# Altium project MSXIV_Front_Power_Distribution.PrjPcb (part 3 of 4)

## Sheet Power Distribution - Pi.SchDoc: Title
size B; Organization: Midnight Sun Solar Rayce Car Team; Address1: University of Waterloo; Address2: 200 University Ave W; Address3: Waterloo, ON, Canada; Address4: N2L 3E9; Website: www.uwmidsun.com; ProjectName: ProjectName
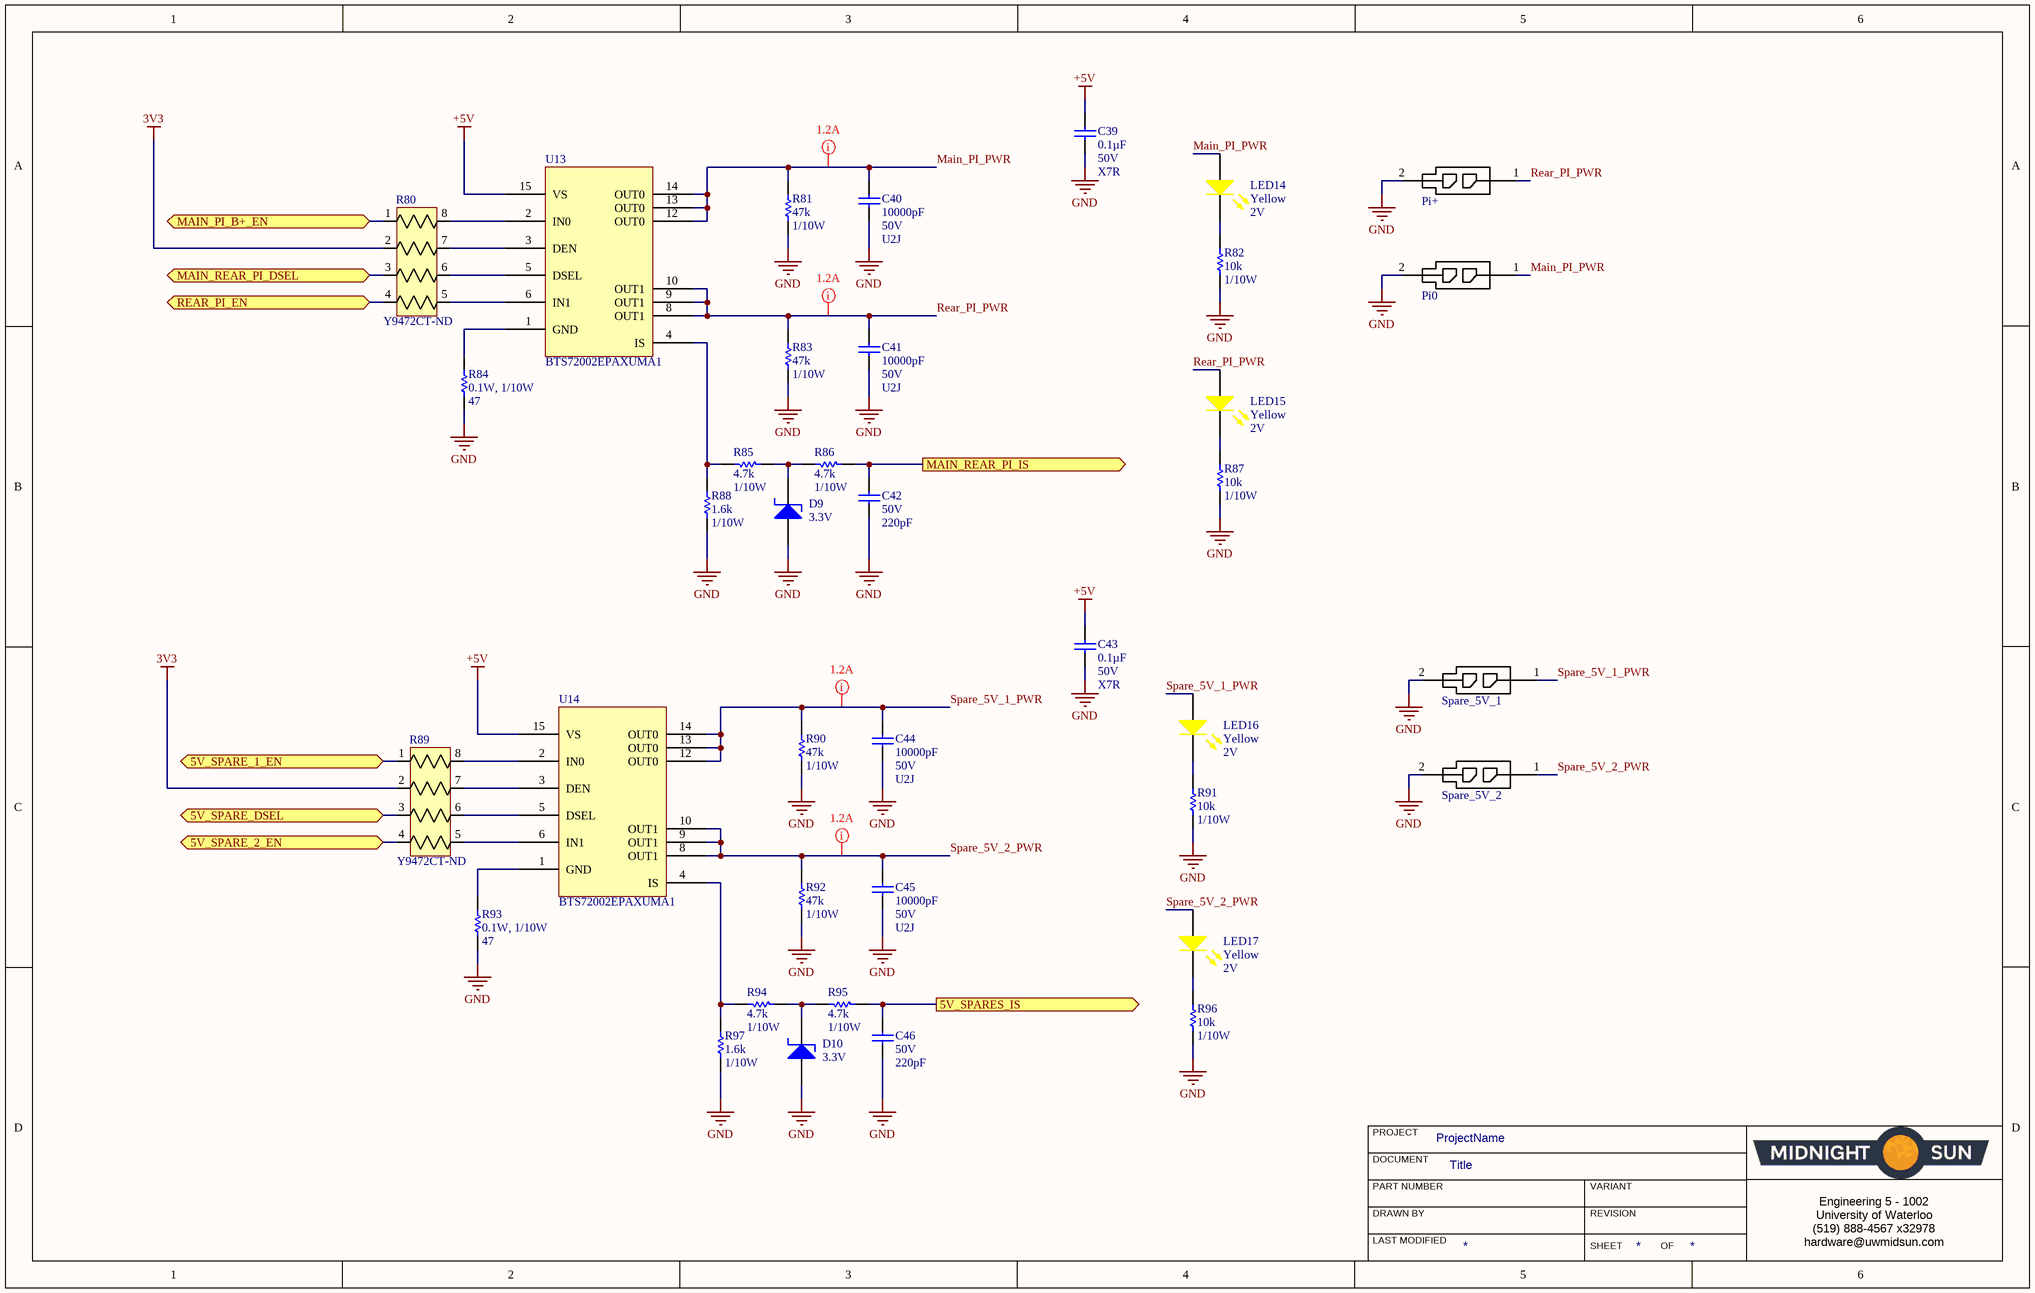
[diagram p5: Power Distribution - Pi.SchDoc]

### Parts
C39  Capacitance: 0.1µF  Voltage: 50V  Temperature Coefficient: X7R  [CAP, 0603]  (hidden comment: CAP CER 0.1UF 50V 10% X7R 0603)
C40  Capacitance: 10000pF  Voltage: 50V  Temperature Coefficient: U2J  [CAP, 0603]  (hidden comment: CAP CER 10nF 50V 5% X7R 0603)
C41  Capacitance: 10000pF  Voltage: 50V  Temperature Coefficient: U2J  [CAP, 0603]  (hidden comment: CAP CER 10nF 50V 5% X7R 0603)
C42  Voltage Rating: 50V  Capacitance: 220pF  [CAP, 0603]  (hidden comment: CAP CER 220PF 50V C0G/NP0 0603)
C43  Capacitance: 0.1µF  Voltage: 50V  Temperature Coefficient: X7R  [CAP, 0603]  (hidden comment: CAP CER 0.1UF 50V 10% X7R 0603)
C44  Capacitance: 10000pF  Voltage: 50V  Temperature Coefficient: U2J  [CAP, 0603]  (hidden comment: CAP CER 10nF 50V 5% X7R 0603)
C45  Capacitance: 10000pF  Voltage: 50V  Temperature Coefficient: U2J  [CAP, 0603]  (hidden comment: CAP CER 10nF 50V 5% X7R 0603)
C46  Voltage Rating: 50V  Capacitance: 220pF  [CAP, 0603]  (hidden comment: CAP CER 220PF 50V C0G/NP0 0603)
D9  Voltage: 3.3V  [sod-323]  (hidden comment: DIODE ZENER 3.3V 200MW SOD323)
D10  Voltage: 3.3V  [sod-323]  (hidden comment: DIODE ZENER 3.3V 200MW SOD323)
LED14  Color: Yellow  Voltage - Forward (Vf) (Typ): 2V  [LED_0603]  (hidden comment: LED YELLOW CLEAR 2.1V 0603)
LED15  Color: Yellow  Voltage - Forward (Vf) (Typ): 2V  [LED_0603]  (hidden comment: LED YELLOW CLEAR 2.1V 0603)
LED16  Color: Yellow  Voltage - Forward (Vf) (Typ): 2V  [LED_0603]  (hidden comment: LED YELLOW CLEAR 2.1V 0603)
LED17  Color: Yellow  Voltage - Forward (Vf) (Typ): 2V  [LED_0603]  (hidden comment: LED YELLOW CLEAR 2.1V 0603)
Pi0  CONN 2POS MICRO-FIT 3mm  [CONN, 2POS MICRO-FIT]  (value not drawn)
Pi+  CONN 2POS MICRO-FIT 3mm  [CONN, 2POS MICRO-FIT]  (value not drawn)
R80  Supplier Part Number 1: Y9472CT-ND  [RES ARRAY 4RES 1206]  (hidden comment: RES ARRAY 4 RES 4.7K OHM 1206)
R81  Resistance: 47k  Power Rating: 1/10W  [RES, 0603]  (hidden comment: RES 47K OHM 1% 1/10W 0603)
R82  Resistance: 10k  Power: 1/10W  [RES, 0603]  (hidden comment: RES 10K OHM 1% 1/10W 0603)
R83  Resistance: 47k  Power Rating: 1/10W  [RES, 0603]  (hidden comment: RES 47K OHM 1% 1/10W 0603)
R84  Power (Watts): 0.1W, 1/10W  Values: 47  [RES, 0603]  (hidden comment: RES SMD 47 OHM 1% 1/10W 0603)
R85  Resistance (Ohms): 4.7k  Power (Watts): 1/10W  [RES, 0603]  (hidden comment: RES 4.7K OHM 1% 1/10W 0603)
R86  Resistance (Ohms): 4.7k  Power (Watts): 1/10W  [RES, 0603]  (hidden comment: RES 4.7K OHM 1% 1/10W 0603)
R87  Resistance: 10k  Power: 1/10W  [RES, 0603]  (hidden comment: RES 10K OHM 1% 1/10W 0603)
R88  Resistance: 1.6k  Power Rating: 1/10W  [RES, 0603]  (hidden comment: RES 1.6K OHM 1% 1/10W 0603)
R89  Supplier Part Number 1: Y9472CT-ND  [RES ARRAY 4RES 1206]  (hidden comment: RES ARRAY 4 RES 4.7K OHM 1206)
R90  Resistance: 47k  Power Rating: 1/10W  [RES, 0603]  (hidden comment: RES 47K OHM 1% 1/10W 0603)
R91  Resistance: 10k  Power: 1/10W  [RES, 0603]  (hidden comment: RES 10K OHM 1% 1/10W 0603)
R92  Resistance: 47k  Power Rating: 1/10W  [RES, 0603]  (hidden comment: RES 47K OHM 1% 1/10W 0603)
R93  Power (Watts): 0.1W, 1/10W  Values: 47  [RES, 0603]  (hidden comment: RES SMD 47 OHM 1% 1/10W 0603)
R94  Resistance (Ohms): 4.7k  Power (Watts): 1/10W  [RES, 0603]  (hidden comment: RES 4.7K OHM 1% 1/10W 0603)
R95  Resistance (Ohms): 4.7k  Power (Watts): 1/10W  [RES, 0603]  (hidden comment: RES 4.7K OHM 1% 1/10W 0603)
R96  Resistance: 10k  Power: 1/10W  [RES, 0603]  (hidden comment: RES 10K OHM 1% 1/10W 0603)
R97  Resistance: 1.6k  Power Rating: 1/10W  [RES, 0603]  (hidden comment: RES 1.6K OHM 1% 1/10W 0603)
Spare_5V_1  CONN 2POS MICRO-FIT 3mm  [CONN, 2POS MICRO-FIT]  (value not drawn)
Spare_5V_2  CONN 2POS MICRO-FIT 3mm  [CONN, 2POS MICRO-FIT]  (value not drawn)
U13  Manufacturer Part Number: BTS72002EPAXUMA1  [IC LOAD SWITCH PG-TSDSO-14-22]  (hidden comment: IC LOAD SWITCH BTS7200-2EPA PG-TSDSO-14_1)
U14  Manufacturer Part Number: BTS72002EPAXUMA1  [IC LOAD SWITCH PG-TSDSO-14-22]  (hidden comment: IC LOAD SWITCH BTS7200-2EPA PG-TSDSO-14_1)

### Ports
5V_SPARE_1_EN (bidir), 5V_SPARE_2_EN (bidir), 5V_SPARE_DSEL (bidir), 5V_SPARES_IS (out), MAIN_PI_B+_EN (bidir), MAIN_REAR_PI_DSEL (bidir), MAIN_REAR_PI_IS (out), REAR_PI_EN (bidir)

### Nets
3V3: R80.2 R89.2
+5V: C39.1 C43.1 U13.15(VS) U14.15(VS)
GND: C39.2 C40.2 C41.2 C42.2 C43.2 C44.2 C45.2 C46.2 D9.1(A) D10.1(A) Pi0.2 Pi+.2 R81.2 R82.2 R83.2 R84.2 R87.2 R88.2 R90.2 R91.2 R92.2 R93.2 R96.2 R97.2 Spare_5V_1.2 Spare_5V_2.2
Main_PI_PWR: C40.1 LED14.1(A) Pi0.1 R81.1 U13.12(OUT0) U13.13(OUT0) U13.14(OUT0)
Rear_PI_PWR: C41.1 LED15.1(A) Pi+.1 R83.1 U13.8(OUT1) U13.9(OUT1) U13.10(OUT1)
Spare_5V_1_PWR: C44.1 LED16.1(A) R90.1 Spare_5V_1.1 U14.12(OUT0) U14.13(OUT0) U14.14(OUT0)
Spare_5V_2_PWR: C45.1 LED17.1(A) R92.1 Spare_5V_2.1 U14.8(OUT1) U14.9(OUT1) U14.10(OUT1)
NetC42_1: C42.1 R86.1 ; port MAIN_REAR_PI_IS
NetC46_1: C46.1 R95.1 ; port 5V_SPARES_IS
NetD9_2: D9.2(K) R85.1 R86.2
NetD10_2: D10.2(K) R94.1 R95.2
NetLED14_2: LED14.2(K) R82.1
NetLED15_2: LED15.2(K) R87.1
NetLED16_2: LED16.2(K) R91.1
NetLED17_2: LED17.2(K) R96.1
NetR80_1: R80.1 ; port MAIN_PI_B+_EN
NetR80_3: R80.3 ; port MAIN_REAR_PI_DSEL
NetR80_4: R80.4 ; port REAR_PI_EN
NetR80_5: R80.5 U13.6(IN1)
NetR80_6: R80.6 U13.5(DSEL)
NetR80_7: R80.7 U13.3(DEN)
NetR80_8: R80.8 U13.2(IN0)
NetR84_1: R84.1 U13.1(GND)
NetR85_2: R85.2 R88.1 U13.4(IS)
NetR89_1: R89.1 ; port 5V_SPARE_1_EN
NetR89_3: R89.3 ; port 5V_SPARE_DSEL
NetR89_4: R89.4 ; port 5V_SPARE_2_EN
NetR89_5: R89.5 U14.6(IN1)
NetR89_6: R89.6 U14.5(DSEL)
NetR89_7: R89.7 U14.3(DEN)
NetR89_8: R89.8 U14.2(IN0)
NetR93_1: R93.1 U14.1(GND)
NetR94_2: R94.2 R97.1 U14.4(IS)

### Layout directives
mark named 1.2A: Main_PI_PWR, Rear_PI_PWR, Spare_5V_1_PWR, Spare_5V_2_PWR

### Notes on the sheet
- PROJECT
- DOCUMENT
- DRAWN BY
- LAST MODIFIED
- PART NUMBER
- REVISION
- SHEET
- VARIANT
- OF
- Engineering 5 - 1002
  University of Waterloo
  (519) 888-4567 x32978
  hardware@uwmidsun.com

### Library data of the parts
C39 C43 = CAP CER 0.1UF 50V 10% X7R 0603: as C1 on sheet Controller_Board_Interface; Supplier 1: Digi-Key; Supplier Part Number 1: 478-5052-1-ND; Packaging: Cut Tape (CT); Part Status: Active; Operating Temperature: -55°C ~ 125°C; Ratings: -; Mounting Type: Surface Mount, MLCC; Package / Case: 0603 (1608 Metric); Size / Dimension: 0.063" L x 0.032" W (1.60mm x 0.81mm); Height - Seated (Max): -; Thickness (Max): 0.035" (0.90mm); Lead Spacing: -; Lead Style: -; ComponentLink1URL: http://datasheets.avx.com/X7RDielectric.pdf; ComponentLink1Description: http://datasheets.avx.com/X7RDielectric.pdf; Tolerance: ±10%
C40 C41 C44 C45 = CAP CER 10nF 50V 5% X7R 0603: as C13#1 on sheet Power Distribution - Steering, Pedal, Center Console, and Fan; Supplier 1: Digi-Key; Supplier Part Number 1: 399-13384-1-ND; Packaging: Cut Tape (CT); Part Status: Active; Operating Temperature: -55°C ~ 125°C; Ratings: -; Failure Rate: -; Mounting Type: Surface Mount, MLCC; Package / Case: 0603 (1608 Metric); Size / Dimension: 0.063" L x 0.032" W (1.60mm x 0.80mm); Height - Seated (Max): -; Thickness (Max): 0.034" (0.87mm); Lead Spacing: -; Lead Style: -; ComponentLink1URL: http://www.kemet.com/docfinder?Partnumber=C0603C103J5JAC7867; ComponentLink1Description: http://www.kemet.com/docfinder?Partnumber=C0603C103J5JAC7867; Tolerance: ±5%
C42 C46 = CAP CER 220PF 50V C0G/NP0 0603: as C2#2 on sheet Power Distribution - Steering, Pedal, Center Console, and Fan; Supplier 1: Digi-Key; Supplier Part Number 1: 399-6868-1-ND; Stock 1: 35170; Pricing 1: 1=0.14000, 10=0.09700, 100=0.04550, 500=0.03188, 1000=0.02640 (USD); RoHS: Yes; Mount: Surface Mount; Case/Package: 0603; Case Code (Metric): 1608; Case Code (Imperial): 0603; Contact Plating: Tin; Dielectric Material: Ceramic; Min Operating Temperature: -55°C; Max Operating Temperature: 125°C; Tolerance: 5%; Packaging: Tape and Reel; Package Quantity: 1; Voltage Rating (DC): 50V; Termination: SMD/SMT; Length: 1.6mm; Height: 0.8mm; Width: 0.031inch; Thickness: 0.034inch; Depth: 0.8mm; Ratings: AEC-Q200; Radiation Hardening: No; REACH SVHC: No SVHC; Lead Free: Lead Free; ComponentLink1URL: https://datasheet.ciiva.com/18192/getdatasheetpartid-416741-18192869.pdf?src-supplier=Verical; ComponentLink1Description: https://datasheet.ciiva.com/18192/getdatasheetpartid-416741-18192869.pdf?src-supplier=Verical; ComponentLink2URL: https://datasheet.ciiva.com/22694/1633156-22694015.pdf?src-supplier=Element14; ComponentLink2Description: https://datasheet.ciiva.com/22694/1633156-22694015.pdf?src-supplier=Element14; Dielectric: C0G
D9 D10 = DIODE ZENER 3.3V 200MW SOD323: as D1#1 on sheet Power Distribution - Steering, Pedal, Center Console, and Fan; ComponentLink1Description: http://www.vishay.com/docs/85764/bzx384.pdf; ComponentLink1URL: http://www.vishay.com/docs/85764/bzx384.pdf; Supplier 1: Digi-Key; Supplier Part Number 1: BZX384C3V3-E3-08GICT-ND
LED14-LED17 = LED YELLOW CLEAR 2.1V 0603: as LED2#1 on sheet Power Distribution - Steering, Pedal, Center Console, and Fan; Supplier 1: Digi-Key; RoHS: RoHS Compliant; Category: Optoelectronics; Stock 1: 10523; Pricing 1: 1=0.21, 100=0.1617, 500=0.13964 (CAD); Packaging: Cut Tape (CT); Part Status: Active; Lens Transparency: Clear; Mounting Type: Surface Mount; Wavelength - Dominant: 590nm; Features: -; Package / Case: 0603 (1608 Metric); Supplier Device Package: 0603; Size / Dimension: 1.60mm L x 0.80mm W; Height (Max): 0.80mm; ComponentLink1URL: http://katalog.we-online.de/led/datasheet/150060YS75000.pdf; ComponentLink1Description: http://katalog.we-online.de/led/datasheet/150060YS75000.pdf; Supplier Part Number 1: 732-4981-1-ND
Pi0 Pi+ Spare_5V_1 Spare_5V_2 = CONN 2POS MICRO-FIT 3mm: Connector Header Through Hole 2 position; Manufacturer: Molex; Manufacturer Part Number: 43045-0227; Number of Positions: 2; Gender: Male; Contact Resistance: 10mR; Number of Ports: 1; Max Voltage Rating (DC): 250.25kV; Current Rating: 5A; Voltage Rating: 600V; Glow Wire Compliant: Compliant; Supplier 1: Digi-Key; Stock 1: 3657; Pricing 1: 1=0.84, 10=0.74, 25=0.6968, 50=0.6676, 100=0.6387, 250=0.5806, 500=0.52254, 1000=0.46448, 2500=0.42094 (USD); Mount: Through Hole; Contact Plating: Tin; Contact Material: Brass; Housing Colour: Black; Housing Material: Thermoplastic; Number of Terminals: 2; Min Operating Temperature: -40°C; Max Operating Temperature: 105°C; Number of Rows: 2; Packaging: Tray; Termination: Solder; Number of Contacts: 2; Orientation: Vertical; Package Quantity: 3168; Number of Circuits: 2; Length: 7.15mm; Pitch: 3mm; Depth: 8.77mm; Row Spacing: 3mm; Radiation Hardening: No; Halogen Free: Low Halogen; ComponentLink1URL: http://www.onlinecomponents.com/productFiles/mf-MOL/307170430450227_pcb_headers.pdf; ComponentLink1Description: http://www.onlinecomponents.com/productFiles/mf-MOL/307170430450227_pcb_headers.pdf; ComponentLink2URL: http://www.mouser.com/ds/2/276/0430450227_PCB_HEADERS-142611.pdf; ComponentLink2Description: http://www.mouser.com/ds/2/276/0430450227_PCB_HEADERS-142611.pdf; ComponentLink3URL: http://uk.rs-online.com/webdocs/13c3/0900766b813c3a46.pdf; ComponentLink3Description: http://uk.rs-online.com/webdocs/13c3/0900766b813c3a46.pdf; ComponentLink4URL: http://www.molex.com/webdocs/datasheets/pdf/en-us/0430450227_PCB_HEADERS.pdf; ComponentLink4Description: http://www.molex.com/webdocs/datasheets/pdf/en-us/0430450227_PCB_HEADERS.pdf; Supplier Part Number 1: WM10657-ND
R80 R89 = RES ARRAY 4 RES 4.7K OHM 1206: as R23#1 on sheet Power Distribution - Steering, Pedal, Center Console, and Fan; Applications: -; Category: Resistors; Circuit Type: Isolated; Part Status: Active; Resistance (Ohms): 4.7k; Tolerance: ±5%; Power Per Element: 62.5mW; Number of Pins: 8; Operating Temperature: -55°C ~ 125°C; Mounting Type: Surface Mount; Package / Case: 1206 (3216 Metric), Convex, Long Side Terminals; Supplier Device Package: 1206; Size / Dimension: 0.126" L x 0.063" W (3.20mm x 1.60mm); Height - Seated (Max): 0.024" (0.60mm); Packaging: Cut Tape (CT); Resistor Matching Ratio: -; Resistor-Ratio-Drift: -; Series: EXB; ComponentLink1Description: https://industrial.panasonic.com/cdbs/www-data/pdf/AOC0000/AOC0000C14.pdf; ComponentLink1URL: https://industrial.panasonic.com/cdbs/www-data/pdf/AOC0000/AOC0000C14.pdf; Supplier 1: Digi-Key; Temperature Coefficient: ±200ppm/°C
R81 R83 R90 R92 = RES 47K OHM 1% 1/10W 0603: as R24#1 on sheet Power Distribution - Steering, Pedal, Center Console, and Fan; ComponentLink1URL: https://industrial.panasonic.com/cdbs/www-data/pdf/RDO0000/AOA0000C291.pdf; ComponentLink1Description: https://industrial.panasonic.com/cdbs/www-data/pdf/RDO0000/AOA0000C291.pdf; ComponentLink2URL: https://datasheet.ciiva.com/6138/aoa0000ce2-6138149.pdf?src-supplier=Farnell; ComponentLink2Description: https://datasheet.ciiva.com/6138/aoa0000ce2-6138149.pdf?src-supplier=Farnell; ComponentLink3URL: https://datasheet.ciiva.com/7802/aoa0000ce2-7802421.pdf?src-supplier=Element14; ComponentLink3Description: https://datasheet.ciiva.com/7802/aoa0000ce2-7802421.pdf?src-supplier=Element14; ComponentLink4URL: https://datasheet.ciiva.com/48531/aoa0000ce2-48531029.pdf?src-supplier=Avnet; ComponentLink4Description: https://datasheet.ciiva.com/48531/aoa0000ce2-48531029.pdf?src-supplier=Avnet; ComponentLink5URL: https://datasheet.ciiva.com/16514/aoa0000ce2-16514071.pdf?src-supplier=Avnet+Asia; ComponentLink5Description: https://datasheet.ciiva.com/16514/aoa0000ce2-16514071.pdf?src-supplier=Avnet+Asia; ComponentLink6URL: https://datasheet.ciiva.com/46398/1678782-46398088.pdf?src-supplier=Element14; ComponentLink6Description: https://datasheet.ciiva.com/46398/1678782-46398088.pdf?src-supplier=Element14; ComponentLink7URL: https://datasheet.ciiva.com/24069/aoa0000ce2-24069209.pdf?src-supplier=Mouser; ComponentLink7Description: https://datasheet.ciiva.com/24069/aoa0000ce2-24069209.pdf?src-supplier=Mouser; ComponentLink8URL: https://datasheet.ciiva.com/46398/1678782-46398089.pdf?src-supplier=Element14; ComponentLink8Description: https://datasheet.ciiva.com/46398/1678782-46398089.pdf?src-supplier=Element14; ComponentLink9URL: https://datasheet.ciiva.com/30236/aoa0000ce2-30236698.pdf?src-supplier=Onlinecomponents.com; ComponentLink9Description: https://datasheet.ciiva.com/30236/aoa0000ce2-30236698.pdf?src-supplier=Onlinecomponents.com; ComponentLink10URL: https://datasheet.ciiva.com/22722/426256-22722781.pdf?src-supplier=Element14; ComponentLink10Description: https://datasheet.ciiva.com/22722/426256-22722781.pdf?src-supplier=Element14; ComponentLink11URL: https://datasheet.ciiva.com/16758/70260748-16758831.pdf?src-supplier=Allied+Electronics; ComponentLink11Description: https://datasheet.ciiva.com/16758/70260748-16758831.pdf?src-supplier=Allied+Electronics; Supplier 1: Digi-Key; Stock 1: 1704740; Pricing 1: 1 = 0.100000, 10 = 0.065000, 100 = 0.026400, 1000 = 0.011860, 2500 = 0.010290 (USD); RoHS: Yes; Mount: Surface Mount; Case/Package: 0603; Number of Pins: 2; Case Code (Metric): 1608; Case Code (Imperial): 0603; Contact Plating: Tin; Min Operating Temperature: -55°C; Max Operating Temperature: 155°C; Tolerance: 1%; Packaging: Tape and Reel; Package Quantity: 1; Composition: Thick Film; Number of Terminations: 2; Termination: SMD/SMT; Military Standard: Not; Voltage Rating (DC): 75V; Features: Automotive AEC-Q200; Length: 1.6mm; Height: 0.022inch; Width: 0.031inch; Depth: 0.8mm; Radiation Hardening: No; REACH SVHC: No SVHC; Lead Free: Lead Free; Supplier Part Number 1: P47.0KHCT-ND
R82 R87 R91 R96 = RES 10K OHM 1% 1/10W 0603: as R4 on sheet Controller_Board_Interface; Supplier 1: Digi-Key; Supplier Part Number 1: 311-10.0KHRCT-ND; Packaging: Cut Tape (CT); Part Status: Active; Composition: Thick Film; Operating Temperature: -55°C ~ 155°C; Package / Case: 0603 (1608 Metric); Supplier Device Package: 0603; Size / Dimension: 0.063" L x 0.031" W (1.60mm x 0.80mm); Height - Seated (Max): 0.022" (0.55mm); Failure Rate: -; ComponentLink1URL: http://www.yageo.com/documents/recent/PYu-RC_Group_51_RoHS_L_7.pdf; ComponentLink1Description: http://www.yageo.com/documents/recent/PYu-RC_Group_51_RoHS_L_7.pdf; Tolerance: ±1%
R84 R93 = RES SMD 47 OHM 1% 1/10W 0603: as R45 on sheet Power Distribution - Steering, Pedal, Center Console, and Fan; Operating Temperature: -55°C ~ 155°C; Features: Automotive AEC-Q200, Moisture Resistant; Tolerance: ±1%; Composition: Thick Film; Ratings: AEC-Q200; Package / Case: 0603 (1608 Metric); Number of Terminations: 2; Height - Seated (Max): 0.022" (0.55mm); Size / Dimension: 0.063" L x 0.031" W (1.60mm x 0.80mm); ComponentLink1Description: https://www.yageo.com/upload/media/product/productsearch/datasheet/rchip/PYu-AC_51_RoHS_L_7.pdf; ComponentLink1URL: https://www.yageo.com/upload/media/product/productsearch/datasheet/rchip/PYu-AC_51_RoHS_L_7.pdf; Supplier 1: Digi-Key; Supplier Part Number 1: 311-47LDCT-ND; Supplier Device Package: 0603
R85 R86 R94 R95 = RES 4.7K OHM 1% 1/10W 0603: as R7 on sheet Controller_Board_Interface; Supplier 1: Digi-Key; Supplier Part Number 1: 311-4.70KHRCT-ND; RoHS: RoHS Compliant; Category: Resistors; Stock 1: 3487566; Pricing 1: 1=0.16, 10=0.022, 100=0.0089, 1000=0.00402, 2500=0.00349 (CAD); Packaging: Cut Tape (CT); Part Status: Active; Composition: Thick Film; Features: Moisture Resistant; Operating Temperature: -55°C ~ 155°C; Package / Case: 0603 (1608 Metric); Supplier Device Package: 0603; Size / Dimension: 0.063" L x 0.031" W (1.60mm x 0.80mm); Height - Seated (Max): 0.022" (0.55mm); Failure Rate: -; ComponentLink1URL: http://www.yageo.com/documents/recent/PYu-RC_Group_51_RoHS_L_7.pdf; ComponentLink1Description: http://www.yageo.com/documents/recent/PYu-RC_Group_51_RoHS_L_7.pdf; Tolerance: ±1%
R88 R97 = RES 1.6K OHM 1% 1/10W 0603: 1.6 kOhms ±1% 0.1W, 1/10W Chip Resistor 0603 (1608 Metric) Moisture Resistant Thick Film; Manufacturer: Yageo; Manufacturer Part Number: RC0603FR-071K6L; Voltage Rating: 50V; Temperature Coefficient: 100ppm/°C; Working Voltage: 75V; Supplier 1: Digi-Key; Stock 1: 189550; Pricing 1: 1=0.1, 10=0.015, 100=0.006, 1000=0.0027, 2500=0.0023 (USD); Case/Package: 0603; Case Code (Imperial): 0603; Case Code (Metric): 1608; Min Operating Temperature: -55°C; Max Operating Temperature: 155°C; Tolerance: 1%; Packaging: Tape and Reel; Termination: SMD/SMT; Composition: Thick Film; Military Standard: Not; Voltage Rating (DC): 50V; Number of Terminations: 2; Length: 1.6mm; Depth: 0.8mm; Lead Free: Lead Free; ComponentLink1URL: http://components.arrow.com/part/dataview/0323_00200779; ComponentLink1Description: http://components.arrow.com/part/dataview/0323_00200779; ComponentLink2URL: http://www.yageo.com.tw/exep/pages/download/literatures/PYu-R_INT-thick_7.pdf; ComponentLink2Description: http://www.yageo.com.tw/exep/pages/download/literatures/PYu-R_INT-thick_7.pdf; ComponentLink3URL: http://www.mouser.com/ds/2/447/RC0603-272842.pdf; ComponentLink3Description: http://www.mouser.com/ds/2/447/RC0603-272842.pdf; ComponentLink4URL: http://www.yageo.com/documents/recent/PYu-RC0603_51_RoHS_L_v5.pdf; ComponentLink4Description: http://www.yageo.com/documents/recent/PYu-RC0603_51_RoHS_L_v5.pdf; Supplier Part Number 1: 311-1.60KHRCT-ND
U13 U14 = IC LOAD SWITCH BTS7200-2EPA PG-TSDSO-14_1: as U6 on sheet Power Distribution - Steering, Pedal, Center Console, and Fan; Supplier 1: Digi-Key; Supplier Part Number 1: BTS72002EPAXUMA1CT-ND; Stock 1: 1973; Pricing 1: 1=1.31000, 10=1.17500, 100=0.91640, 500=0.75700, 1000=0.59763 (USD); RoHS: No; ComponentLink1Description: https://www.infineon.com/dgdl/Infineon-BTS7200-2EPA-DS-v01_00-EN.pdf?fileId=5546d462636cc8fb016421e548a61215; ComponentLink1URL: https://www.infineon.com/dgdl/Infineon-BTS7200-2EPA-DS-v01_00-EN.pdf?fileId=5546d462636cc8fb016421e548a61215

## Sheet Power Distribution - Display.SchDoc: Title
size B; Organization: Midnight Sun Solar Rayce Car Team; Address1: University of Waterloo; Address2: 200 University Ave W; Address3: Waterloo, ON, Canada; Address4: N2L 3E9; Website: www.uwmidsun.com; ProjectName: ProjectName
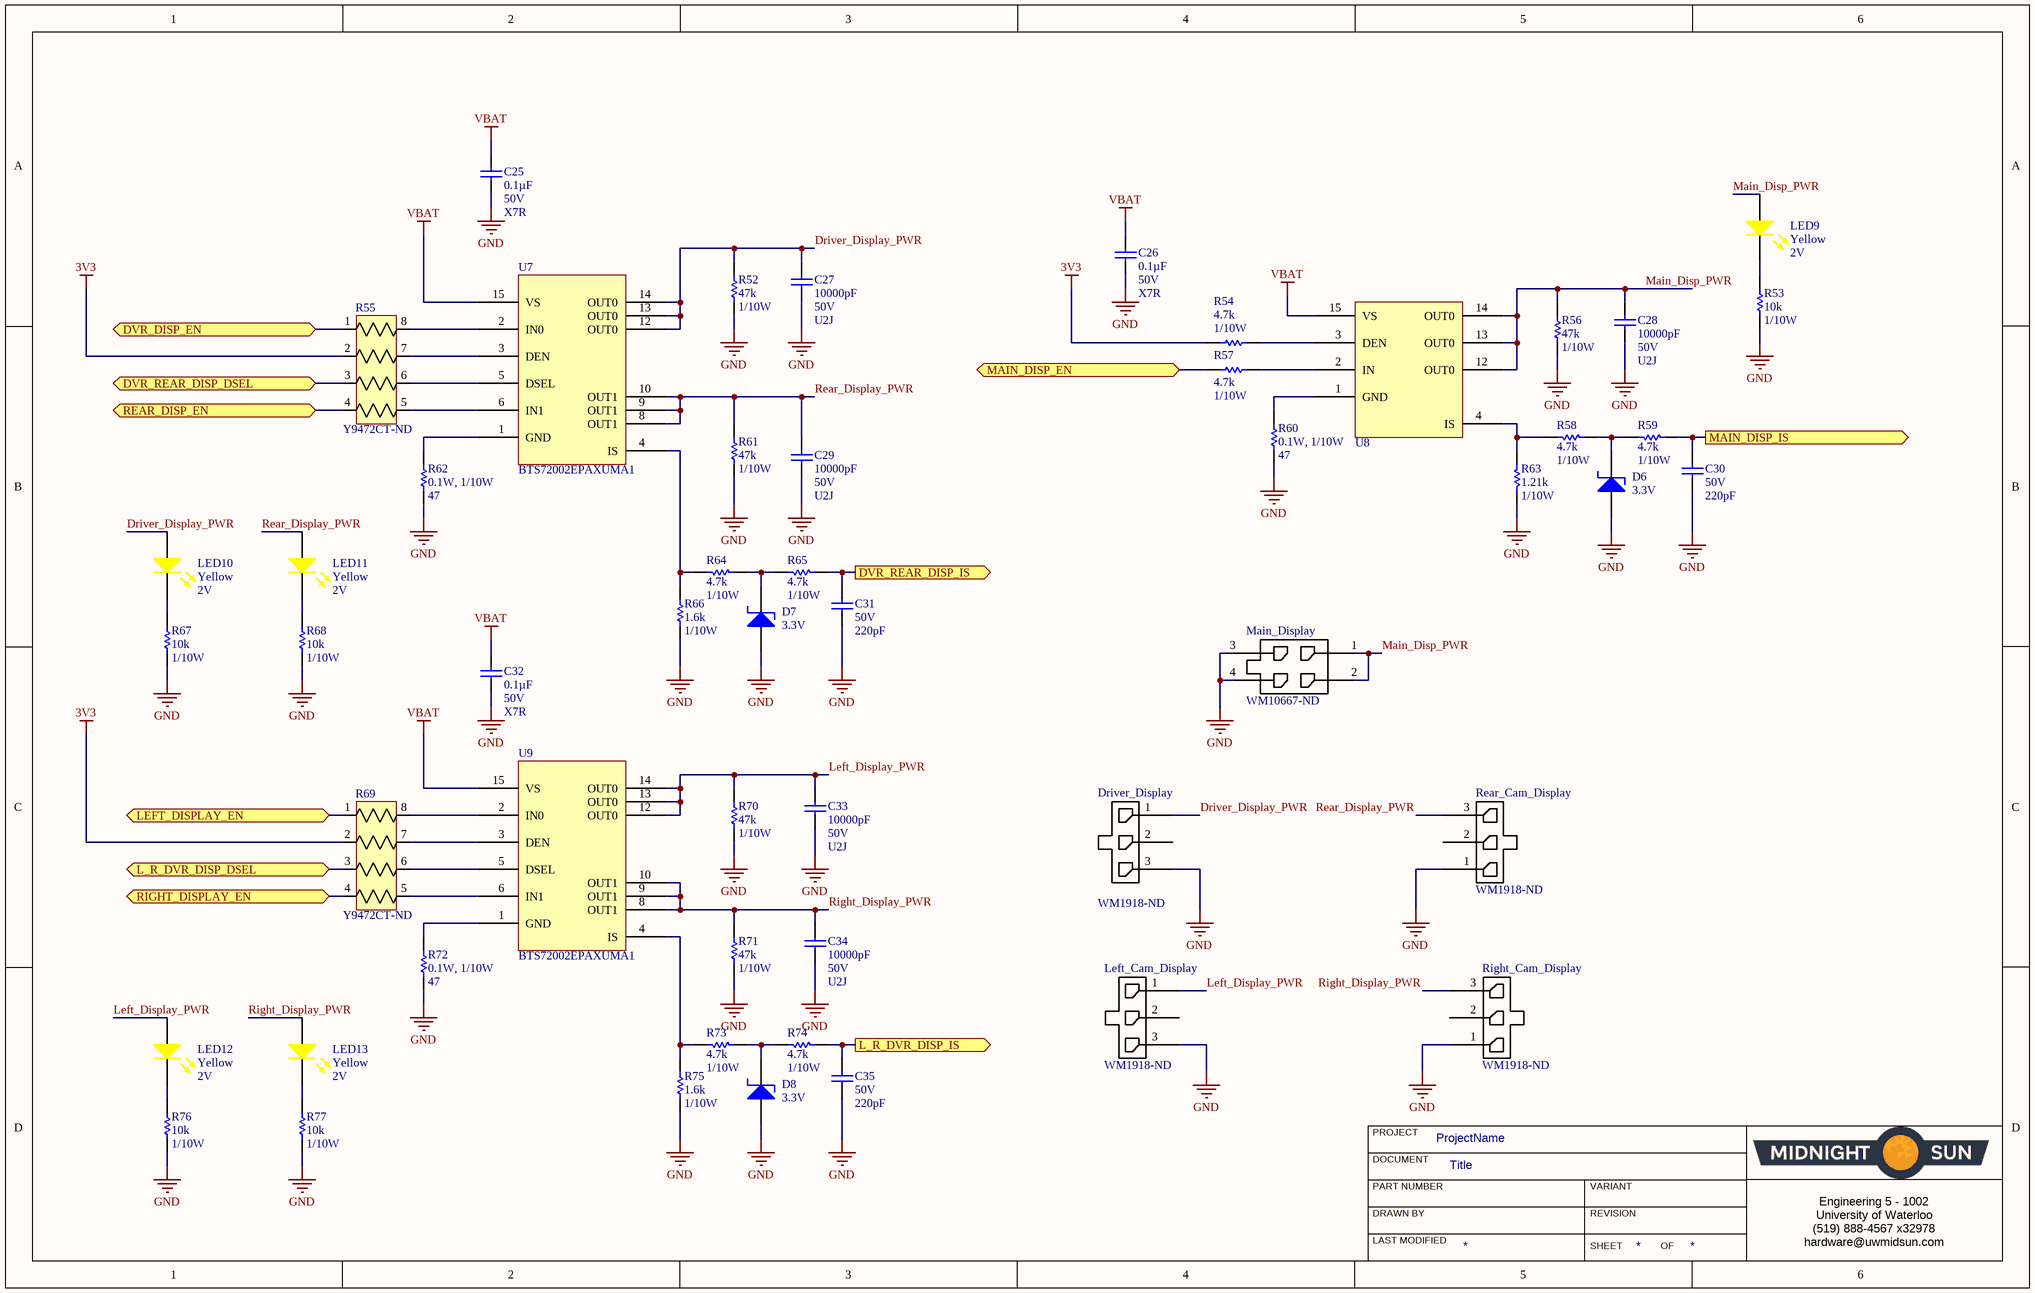
[diagram p6: Power Distribution - Display.SchDoc]

### Parts
(Parts that share a designator on the sheet are numbered #1, #2 ... from top to bottom, then left to right.)
C25  Capacitance: 0.1µF  Voltage: 50V  Temperature Coefficient: X7R  [CAP, 0603]  (hidden comment: CAP CER 0.1UF 50V 10% X7R 0603)
C26  Capacitance: 0.1µF  Voltage: 50V  Temperature Coefficient: X7R  [CAP, 0603]  (hidden comment: CAP CER 0.1UF 50V 10% X7R 0603)
C27  Capacitance: 10000pF  Voltage: 50V  Temperature Coefficient: U2J  [CAP, 0603]  (hidden comment: CAP CER 10nF 50V 5% X7R 0603)
C28#2  Capacitance: 10000pF  Voltage: 50V  Temperature Coefficient: U2J  [CAP, 0603]  (hidden comment: CAP CER 10nF 50V 5% X7R 0603)
C29#2  Capacitance: 10000pF  Voltage: 50V  Temperature Coefficient: U2J  [CAP, 0603]  (hidden comment: CAP CER 10nF 50V 5% X7R 0603)
C30#2  Voltage Rating: 50V  Capacitance: 220pF  [CAP, 0603]  (hidden comment: CAP CER 220PF 50V C0G/NP0 0603)
C31#2  Voltage Rating: 50V  Capacitance: 220pF  [CAP, 0603]  (hidden comment: CAP CER 220PF 50V C0G/NP0 0603)
C32  Capacitance: 0.1µF  Voltage: 50V  Temperature Coefficient: X7R  [CAP, 0603]  (hidden comment: CAP CER 0.1UF 50V 10% X7R 0603)
C33  Capacitance: 10000pF  Voltage: 50V  Temperature Coefficient: U2J  [CAP, 0603]  (hidden comment: CAP CER 10nF 50V 5% X7R 0603)
C34  Capacitance: 10000pF  Voltage: 50V  Temperature Coefficient: U2J  [CAP, 0603]  (hidden comment: CAP CER 10nF 50V 5% X7R 0603)
C35  Voltage Rating: 50V  Capacitance: 220pF  [CAP, 0603]  (hidden comment: CAP CER 220PF 50V C0G/NP0 0603)
D6  Voltage: 3.3V  [sod-323]  (hidden comment: DIODE ZENER 3.3V 200MW SOD323)
D7  Voltage: 3.3V  [sod-323]  (hidden comment: DIODE ZENER 3.3V 200MW SOD323)
D8  Voltage: 3.3V  [sod-323]  (hidden comment: DIODE ZENER 3.3V 200MW SOD323)
Driver_Display  Supplier Part Number 1: WM1918-ND  [CONN, 3 POS MICROFIT]  (hidden comment: CONN 3POS MICROFIT)
LED9#2  Color: Yellow  Voltage - Forward (Vf) (Typ): 2V  [LED_0603]  (hidden comment: LED YELLOW CLEAR 2.1V 0603)
LED10  Color: Yellow  Voltage - Forward (Vf) (Typ): 2V  [LED_0603]  (hidden comment: LED YELLOW CLEAR 2.1V 0603)
LED11  Color: Yellow  Voltage - Forward (Vf) (Typ): 2V  [LED_0603]  (hidden comment: LED YELLOW CLEAR 2.1V 0603)
LED12  Color: Yellow  Voltage - Forward (Vf) (Typ): 2V  [LED_0603]  (hidden comment: LED YELLOW CLEAR 2.1V 0603)
LED13  Color: Yellow  Voltage - Forward (Vf) (Typ): 2V  [LED_0603]  (hidden comment: LED YELLOW CLEAR 2.1V 0603)
Left_Cam_Display  Supplier Part Number 1: WM1918-ND  [CONN, 3 POS MICROFIT]  (hidden comment: CONN 3POS MICROFIT)
Main_Display  Supplier Part Number 1: WM10667-ND  [CONN 4POS MICROFIT (2x2)]  (hidden comment: CONN 4POS MICRO-FIT 3mm)
R52#2  Resistance: 47k  Power Rating: 1/10W  [RES, 0603]  (hidden comment: RES 47K OHM 1% 1/10W 0603)
R53#2  Resistance: 10k  Power: 1/10W  [RES, 0603]  (hidden comment: RES 10K OHM 1% 1/10W 0603)
R54#2  Resistance (Ohms): 4.7k  Power (Watts): 1/10W  [RES, 0603]  (hidden comment: RES 4.7K OHM 1% 1/10W 0603)
R55#2  Supplier Part Number 1: Y9472CT-ND  [RES ARRAY 4RES 1206]  (hidden comment: RES ARRAY 4 RES 4.7K OHM 1206)
R56#2  Resistance: 47k  Power Rating: 1/10W  [RES, 0603]  (hidden comment: RES 47K OHM 1% 1/10W 0603)
R57#2  Resistance (Ohms): 4.7k  Power (Watts): 1/10W  [RES, 0603]  (hidden comment: RES 4.7K OHM 1% 1/10W 0603)
R58#2  Resistance (Ohms): 4.7k  Power (Watts): 1/10W  [RES, 0603]  (hidden comment: RES 4.7K OHM 1% 1/10W 0603)
R59#2  Resistance (Ohms): 4.7k  Power (Watts): 1/10W  [RES, 0603]  (hidden comment: RES 4.7K OHM 1% 1/10W 0603)
R60#2  Power (Watts): 0.1W, 1/10W  Values: 47  [RES, 0603]  (hidden comment: RES SMD 47 OHM 1% 1/10W 0603)
R61#2  Resistance: 47k  Power Rating: 1/10W  [RES, 0603]  (hidden comment: RES 47K OHM 1% 1/10W 0603)
R62#2  Power (Watts): 0.1W, 1/10W  Values: 47  [RES, 0603]  (hidden comment: RES SMD 47 OHM 1% 1/10W 0603)
R63  Resistance: 1.21k  Power: 1/10W  [RES, 0603]  (hidden comment: RES 1.21K OHM 1% 1/10W 0603)
R64  Resistance (Ohms): 4.7k  Power (Watts): 1/10W  [RES, 0603]  (hidden comment: RES 4.7K OHM 1% 1/10W 0603)
R65  Resistance (Ohms): 4.7k  Power (Watts): 1/10W  [RES, 0603]  (hidden comment: RES 4.7K OHM 1% 1/10W 0603)
R66  Resistance: 1.6k  Power Rating: 1/10W  [RES, 0603]  (hidden comment: RES 1.6K OHM 1% 1/10W 0603)
R67  Resistance: 10k  Power: 1/10W  [RES, 0603]  (hidden comment: RES 10K OHM 1% 1/10W 0603)
R68  Resistance: 10k  Power: 1/10W  [RES, 0603]  (hidden comment: RES 10K OHM 1% 1/10W 0603)
R69  Supplier Part Number 1: Y9472CT-ND  [RES ARRAY 4RES 1206]  (hidden comment: RES ARRAY 4 RES 4.7K OHM 1206)
R70  Resistance: 47k  Power Rating: 1/10W  [RES, 0603]  (hidden comment: RES 47K OHM 1% 1/10W 0603)
R71  Resistance: 47k  Power Rating: 1/10W  [RES, 0603]  (hidden comment: RES 47K OHM 1% 1/10W 0603)
R72  Power (Watts): 0.1W, 1/10W  Values: 47  [RES, 0603]  (hidden comment: RES SMD 47 OHM 1% 1/10W 0603)
R73  Resistance (Ohms): 4.7k  Power (Watts): 1/10W  [RES, 0603]  (hidden comment: RES 4.7K OHM 1% 1/10W 0603)
R74  Resistance (Ohms): 4.7k  Power (Watts): 1/10W  [RES, 0603]  (hidden comment: RES 4.7K OHM 1% 1/10W 0603)
R75  Resistance: 1.6k  Power Rating: 1/10W  [RES, 0603]  (hidden comment: RES 1.6K OHM 1% 1/10W 0603)
R76  Resistance: 10k  Power: 1/10W  [RES, 0603]  (hidden comment: RES 10K OHM 1% 1/10W 0603)
R77  Resistance: 10k  Power: 1/10W  [RES, 0603]  (hidden comment: RES 10K OHM 1% 1/10W 0603)
Rear_Cam_Display  Supplier Part Number 1: WM1918-ND  [CONN, 3 POS MICROFIT]  (hidden comment: CONN 3POS MICROFIT)
Right_Cam_Display  Supplier Part Number 1: WM1918-ND  [CONN, 3 POS MICROFIT]  (hidden comment: CONN 3POS MICROFIT)
U7#2  Manufacturer Part Number: BTS72002EPAXUMA1  [IC LOAD SWITCH PG-TSDSO-14-22]  (hidden comment: IC LOAD SWITCH BTS7200-2EPA PG-TSDSO-14_1)
U8  IC LOAD SWITCH BTS70401EPA PG-TSDSO-14-22  [IC LOAD SWITCH PG-TSDSO-14-22]  (value not drawn)
U9  Manufacturer Part Number: BTS72002EPAXUMA1  [IC LOAD SWITCH PG-TSDSO-14-22]  (hidden comment: IC LOAD SWITCH BTS7200-2EPA PG-TSDSO-14_1)

### Ports
DVR_DISP_EN (bidir), DVR_REAR_DISP_DSEL (bidir), DVR_REAR_DISP_IS (out), L_R_DVR_DISP_DSEL (bidir), L_R_DVR_DISP_IS (out), LEFT_DISPLAY_EN (bidir), MAIN_DISP_EN (bidir), MAIN_DISP_IS (out), REAR_DISP_EN (bidir), RIGHT_DISPLAY_EN (bidir)

### Nets
3V3: R54#2.1 R55#2.2 R69.2
GND: C25.2 C26.2 C27.2 C28#2.2 C29#2.2 C30#2.2 C31#2.2 C32.2 C33.2 C34.2 C35.2 D6.1(A) D7.1(A) D8.1(A) Driver_Display.3 Left_Cam_Display.3 Main_Display.3 Main_Display.4 R52#2.2 R53#2.2 R56#2.2 R60#2.2 R61#2.2 R62#2.2 R63.2 R66.2 R67.2 R68.2 R70.2 R71.2 R72.2 R75.2 R76.2 R77.2 Rear_Cam_Display.1 Right_Cam_Display.1
VBAT: C25.1 C26.1 C32.1 U7#2.15(VS) U8.15(VS) U9.15(VS)
Driver_Display_PWR: C27.1 Driver_Display.1 LED10.1(A) R52#2.1 U7#2.12(OUT0) U7#2.13(OUT0) U7#2.14(OUT0)
Left_Display_PWR: C33.1 LED12.1(A) Left_Cam_Display.1 R70.1 U9.12(OUT0) U9.13(OUT0) U9.14(OUT0)
Main_Disp_PWR: C28#2.1 LED9#2.1(A) Main_Display.1 Main_Display.2 R56#2.1 U8.12(OUT0) U8.13(OUT0) U8.14(OUT0)
Rear_Display_PWR: C29#2.1 LED11.1(A) R61#2.1 Rear_Cam_Display.3 U7#2.8(OUT1) U7#2.9(OUT1) U7#2.10(OUT1)
Right_Display_PWR: C34.1 LED13.1(A) R71.1 Right_Cam_Display.3 U9.8(OUT1) U9.9(OUT1) U9.10(OUT1)
NetC30#2_1: C30#2.1 R59#2.1 ; port MAIN_DISP_IS
NetC31#2_1: C31#2.1 R65.1 ; port DVR_REAR_DISP_IS
NetC35_1: C35.1 R74.1 ; port L_R_DVR_DISP_IS
NetD6_2: D6.2(K) R58#2.1 R59#2.2
NetD7_2: D7.2(K) R64.1 R65.2
NetD8_2: D8.2(K) R73.1 R74.2
NetLED9#2_2: LED9#2.2(K) R53#2.1
NetLED10_2: LED10.2(K) R67.1
NetLED11_2: LED11.2(K) R68.1
NetLED12_2: LED12.2(K) R76.1
NetLED13_2: LED13.2(K) R77.1
NetR54#2_2: R54#2.2 U8.3(DEN)
NetR55#2_1: R55#2.1 ; port DVR_DISP_EN
NetR55#2_3: R55#2.3 ; port DVR_REAR_DISP_DSEL
NetR55#2_4: R55#2.4 ; port REAR_DISP_EN
NetR55#2_5: R55#2.5 U7#2.6(IN1)
NetR55#2_6: R55#2.6 U7#2.5(DSEL)
NetR55#2_7: R55#2.7 U7#2.3(DEN)
NetR55#2_8: R55#2.8 U7#2.2(IN0)
NetR57#2_1: R57#2.1 ; port MAIN_DISP_EN
NetR57#2_2: R57#2.2 U8.2(IN)
NetR58#2_2: R58#2.2 R63.1 U8.4(IS)
NetR60#2_1: R60#2.1 U8.1(GND)
NetR62#2_1: R62#2.1 U7#2.1(GND)
NetR64_2: R64.2 R66.1 U7#2.4(IS)
NetR69_1: R69.1 ; port LEFT_DISPLAY_EN
NetR69_3: R69.3 ; port L_R_DVR_DISP_DSEL
NetR69_4: R69.4 ; port RIGHT_DISPLAY_EN
NetR69_5: R69.5 U9.6(IN1)
NetR69_6: R69.6 U9.5(DSEL)
NetR69_7: R69.7 U9.3(DEN)
NetR69_8: R69.8 U9.2(IN0)
NetR72_1: R72.1 U9.1(GND)
NetR73_2: R73.2 R75.1 U9.4(IS)

Not connected (* = marked no-connect by the designer): Driver_Display 2(21); Left_Cam_Display 2(21); Rear_Cam_Display 2(21); Right_Cam_Display 2(21)

### Notes on the sheet
- PROJECT
- DOCUMENT
- DRAWN BY
- LAST MODIFIED
- PART NUMBER
- REVISION
- SHEET
- VARIANT
- OF
- Engineering 5 - 1002
  University of Waterloo
  (519) 888-4567 x32978
  hardware@uwmidsun.com

### Library data of the parts
C25 C26 C32 = CAP CER 0.1UF 50V 10% X7R 0603: 0.10µF ±10% 50V Ceramic Capacitor X7R 0603 (1608 Metric); Manufacturer 1: AVX Corporation; Manufacturer Part Number 1: 06035C104KAT2A; Supplier 1: Digi-Key; Supplier Part Number 1: 478-5052-1-ND; Packaging: Cut Tape (CT); Part Status: Active; Operating Temperature: -55°C ~ 125°C; Ratings: -; Mounting Type: Surface Mount, MLCC; Package / Case: 0603 (1608 Metric); Size / Dimension: 0.063" L x 0.032" W (1.60mm x 0.81mm); Height - Seated (Max): -; Thickness (Max): 0.035" (0.90mm); Lead Spacing: -; Lead Style: -; ComponentLink1URL: http://datasheets.avx.com/X7RDielectric.pdf; ComponentLink1Description: http://datasheets.avx.com/X7RDielectric.pdf; Tolerance: ±10%
C27 C28#2 C29#2 C33 C34 = CAP CER 10nF 50V 5% X7R 0603: 10000pF ±5% 50V Ceramic Capacitor U2J 0603 (1608 Metric); Manufacturer 1: KEMET; Manufacturer Part Number 1: C0603C103J5JAC7867; Supplier 1: Digi-Key; Supplier Part Number 1: 399-13384-1-ND; Packaging: Cut Tape (CT); Part Status: Active; Operating Temperature: -55°C ~ 125°C; Ratings: -; Failure Rate: -; Mounting Type: Surface Mount, MLCC; Package / Case: 0603 (1608 Metric); Size / Dimension: 0.063" L x 0.032" W (1.60mm x 0.80mm); Height - Seated (Max): -; Thickness (Max): 0.034" (0.87mm); Lead Spacing: -; Lead Style: -; ComponentLink1URL: http://www.kemet.com/docfinder?Partnumber=C0603C103J5JAC7867; ComponentLink1Description: http://www.kemet.com/docfinder?Partnumber=C0603C103J5JAC7867; Tolerance: ±5%
C30#2 C31#2 C35 = CAP CER 220PF 50V C0G/NP0 0603: 220pF ±5% 50V Ceramic Capacitor C0G, NP0 0603 (1608 Metric); Manufacturer: KEMET; Manufacturer Part Number: C0603C221J5GACAUTO; Dissipation Factor: 0.1%; Supplier 1: Digi-Key; Supplier Part Number 1: 399-6868-1-ND; Stock 1: 35170; Pricing 1: 1=0.14000, 10=0.09700, 100=0.04550, 500=0.03188, 1000=0.02640 (USD); RoHS: Yes; Mount: Surface Mount; Case/Package: 0603; Case Code (Metric): 1608; Case Code (Imperial): 0603; Contact Plating: Tin; Dielectric Material: Ceramic; Min Operating Temperature: -55°C; Max Operating Temperature: 125°C; Tolerance: 5%; Packaging: Tape and Reel; Package Quantity: 1; Voltage Rating (DC): 50V; Termination: SMD/SMT; Length: 1.6mm; Height: 0.8mm; Width: 0.031inch; Thickness: 0.034inch; Depth: 0.8mm; Ratings: AEC-Q200; Radiation Hardening: No; REACH SVHC: No SVHC; Lead Free: Lead Free; ComponentLink1URL: https://datasheet.ciiva.com/18192/getdatasheetpartid-416741-18192869.pdf?src-supplier=Verical; ComponentLink1Description: https://datasheet.ciiva.com/18192/getdatasheetpartid-416741-18192869.pdf?src-supplier=Verical; ComponentLink2URL: https://datasheet.ciiva.com/22694/1633156-22694015.pdf?src-supplier=Element14; ComponentLink2Description: https://datasheet.ciiva.com/22694/1633156-22694015.pdf?src-supplier=Element14; Dielectric: C0G
D6-D8 = DIODE ZENER 3.3V 200MW SOD323: Zener Diode 3.3V 200mW ±5% Surface Mount SOD-323; ComponentLink1Description: http://www.vishay.com/docs/85764/bzx384.pdf; ComponentLink1URL: http://www.vishay.com/docs/85764/bzx384.pdf; Supplier 1: Digi-Key; Supplier Part Number 1: BZX384C3V3-E3-08GICT-ND
Driver_Display Left_Cam_Display Rear_Cam_Display Right_Cam_Display = CONN 3POS MICROFIT: Connector Header Through Hole 3 position 0.118" (3.00mm); Number of Positions: 3; Number of Positions Loaded: All; Style: Board to Cable/Wire; Shrouding Shrouded: 4 Wall; Contact Length: 0.125" (3.18mm); Mated Stacking Heights: 17.56mm; Material Flammability Rating: UL94 V-0; Packaging: Tray; Number of Rows: 1; Mounting Type: Through Hole; Termination Kinked Pin: Solder; Supplier 1: Digi-Key; Fastening Type: Locking Ramp; Insulation Height: 0.390" (9.91mm); Contact Shape: Square; Contact Finish: Tin; Contact Finish Thickness: 100.0µin (2.54µm); Insulation Material: Liquid Crystal Polymer (LCP), Glass Filled; Contact Material: Brass; Features: Board Guide; Insulation Color: Black; Part Status: Active; Connector Type: Header; Contact Type: Male Pin
LED9#2 LED10-LED13 = LED YELLOW CLEAR 2.1V 0603: Yellow 590nm LED Indication - Discrete 2V 0603 (1608 Metric); Manufacturer: Wurth Electronics Inc.; Manufacturer Part Number: 150060YS75000; Lens Color: Colorless; Millicandela Rating: 120mcd; Lens Style/Size: Rectangle with Flat Top, 1.10mm x 0.70mm; Current - Test: 20mA; Viewing Angle: 140°; Wavelength - Peak: 595nm; Supplier 1: Digi-Key; RoHS: RoHS Compliant; Category: Optoelectronics; Stock 1: 10523; Pricing 1: 1=0.21, 100=0.1617, 500=0.13964 (CAD); Packaging: Cut Tape (CT); Part Status: Active; Lens Transparency: Clear; Mounting Type: Surface Mount; Wavelength - Dominant: 590nm; Features: -; Package / Case: 0603 (1608 Metric); Supplier Device Package: 0603; Size / Dimension: 1.60mm L x 0.80mm W; Height (Max): 0.80mm; ComponentLink1URL: http://katalog.we-online.de/led/datasheet/150060YS75000.pdf; ComponentLink1Description: http://katalog.we-online.de/led/datasheet/150060YS75000.pdf; Supplier Part Number 1: 732-4981-1-ND
Main_Display = CONN 4POS MICRO-FIT 3mm: Micro-Fit 3.0 Vertical Header, 3.00mm Pitch, Dual Row, 4 Circuits, with PCB Polarizing Peg, Tin, Glow-Wire Capable, Black; Manufacturer: Molex, LLC; Manufacturer Part Number: 430450427; Pitch - Mating: 0.118" (3.00mm); Number of Positions: 6; Number of Positions Loaded: All; Style: Board to Cable/Wire; Shrouding: Shrouded - 4 Wall; Contact Length - Post: 0.125" (3.18mm); Material Flammability Rating: UL94 V-0; Contact Resistance: 10mR; Number of Contacts: 4; Number of Ports: 1; Row Spacing: 0.118inch; RoHS: RoHS Compliant; Category: Connectors, Interconnects; Packaging: Tray; Part Status: Active; Connector Type: Header; Contact Type: Male Pin; Number of Rows: 2; Row Spacing - Mating: 0.118" (3.00mm); Mounting Type: Through Hole; Termination: Solder; Fastening Type: Locking Ramp; Contact Length - Mating: -; Overall Contact Length: -; Insulation Height: 0.390" (9.91mm); Contact Shape: Square; Contact Finish - Mating: Tin; Contact Finish Thickness - Mating: 60.0µin (1.52µm); Contact Finish - Post: Tin; Contact Material: Brass; Insulation Material: Liquid Crystal Polymer (LCP), Glass Filled; Features: Board Guide; Operating Temperature: -; Ingress Protection: -; Insulation Color: Black; Current Rating: -; Voltage Rating: -; Mated Stacking Heights: -; Contact Finish Thickness - Post: -; Applications: General Purpose, Medical, Military, Telecommunications; Mount: Through Hole; Contact Plating: Tin; Housing Material: Polymer; Color: Black; Number of Terminals: 4; Housing Color: Black; Min Operating Temperature: -40°C; Max Operating Temperature: 105°C; Package Quantity: 2232; Orientation: Straight; Length: 10.15mm; Pitch: 3mm; Depth: 8.77mm; ComponentLink4URL: http://www.molex.com/webdocs/datasheets/pdf/en-us/0430450427_PCB_HEADERS.pdf; ComponentLink4Description: http://www.molex.com/webdocs/datasheets/pdf/en-us/0430450427_PCB_HEADERS.pdf; Supplier 1: Digi-Key
R52#2 R56#2 R61#2 R70 R71 = RES 47K OHM 1% 1/10W 0603: 47 kOhms ±1% 0.1W, 1/10W Chip Resistor 0603 (1608 Metric) Automotive AEC-Q200 Thick Film; Manufacturer: Panasonic; Manufacturer Part Number: ERJ3EKF4702V; Voltage Rating: 75V; Temperature Coefficient: 100ppm/°C; Working Voltage: 6V; Max Power Dissipation: 100mW; ComponentLink1URL: https://industrial.panasonic.com/cdbs/www-data/pdf/RDO0000/AOA0000C291.pdf; ComponentLink1Description: https://industrial.panasonic.com/cdbs/www-data/pdf/RDO0000/AOA0000C291.pdf; ComponentLink2URL: https://datasheet.ciiva.com/6138/aoa0000ce2-6138149.pdf?src-supplier=Farnell; ComponentLink2Description: https://datasheet.ciiva.com/6138/aoa0000ce2-6138149.pdf?src-supplier=Farnell; ComponentLink3URL: https://datasheet.ciiva.com/7802/aoa0000ce2-7802421.pdf?src-supplier=Element14; ComponentLink3Description: https://datasheet.ciiva.com/7802/aoa0000ce2-7802421.pdf?src-supplier=Element14; ComponentLink4URL: https://datasheet.ciiva.com/48531/aoa0000ce2-48531029.pdf?src-supplier=Avnet; ComponentLink4Description: https://datasheet.ciiva.com/48531/aoa0000ce2-48531029.pdf?src-supplier=Avnet; ComponentLink5URL: https://datasheet.ciiva.com/16514/aoa0000ce2-16514071.pdf?src-supplier=Avnet+Asia; ComponentLink5Description: https://datasheet.ciiva.com/16514/aoa0000ce2-16514071.pdf?src-supplier=Avnet+Asia; ComponentLink6URL: https://datasheet.ciiva.com/46398/1678782-46398088.pdf?src-supplier=Element14; ComponentLink6Description: https://datasheet.ciiva.com/46398/1678782-46398088.pdf?src-supplier=Element14; ComponentLink7URL: https://datasheet.ciiva.com/24069/aoa0000ce2-24069209.pdf?src-supplier=Mouser; ComponentLink7Description: https://datasheet.ciiva.com/24069/aoa0000ce2-24069209.pdf?src-supplier=Mouser; ComponentLink8URL: https://datasheet.ciiva.com/46398/1678782-46398089.pdf?src-supplier=Element14; ComponentLink8Description: https://datasheet.ciiva.com/46398/1678782-46398089.pdf?src-supplier=Element14; ComponentLink9URL: https://datasheet.ciiva.com/30236/aoa0000ce2-30236698.pdf?src-supplier=Onlinecomponents.com; ComponentLink9Description: https://datasheet.ciiva.com/30236/aoa0000ce2-30236698.pdf?src-supplier=Onlinecomponents.com; ComponentLink10URL: https://datasheet.ciiva.com/22722/426256-22722781.pdf?src-supplier=Element14; ComponentLink10Description: https://datasheet.ciiva.com/22722/426256-22722781.pdf?src-supplier=Element14; ComponentLink11URL: https://datasheet.ciiva.com/16758/70260748-16758831.pdf?src-supplier=Allied+Electronics; ComponentLink11Description: https://datasheet.ciiva.com/16758/70260748-16758831.pdf?src-supplier=Allied+Electronics; Supplier 1: Digi-Key; Stock 1: 1704740; Pricing 1: 1 = 0.100000, 10 = 0.065000, 100 = 0.026400, 1000 = 0.011860, 2500 = 0.010290 (USD); RoHS: Yes; Mount: Surface Mount; Case/Package: 0603; Number of Pins: 2; Case Code (Metric): 1608; Case Code (Imperial): 0603; Contact Plating: Tin; Min Operating Temperature: -55°C; Max Operating Temperature: 155°C; Tolerance: 1%; Packaging: Tape and Reel; Package Quantity: 1; Composition: Thick Film; Number of Terminations: 2; Termination: SMD/SMT; Military Standard: Not; Voltage Rating (DC): 75V; Features: Automotive AEC-Q200; Length: 1.6mm; Height: 0.022inch; Width: 0.031inch; Depth: 0.8mm; Radiation Hardening: No; REACH SVHC: No SVHC; Lead Free: Lead Free; Supplier Part Number 1: P47.0KHCT-ND
R53#2 R67 R68 R76 R77 = RES 10K OHM 1% 1/10W 0603: RES SMD 10K OHM 1% 1/10W 0603; Manufacturer 1: Yageo; Manufacturer Part Number 1: RC0603FR-0710KL; Temperature Coefficient: ±100ppm/°C; Supplier 1: Digi-Key; Supplier Part Number 1: 311-10.0KHRCT-ND; Packaging: Cut Tape (CT); Part Status: Active; Composition: Thick Film; Operating Temperature: -55°C ~ 155°C; Package / Case: 0603 (1608 Metric); Supplier Device Package: 0603; Size / Dimension: 0.063" L x 0.031" W (1.60mm x 0.80mm); Height - Seated (Max): 0.022" (0.55mm); Failure Rate: -; ComponentLink1URL: http://www.yageo.com/documents/recent/PYu-RC_Group_51_RoHS_L_7.pdf; ComponentLink1Description: http://www.yageo.com/documents/recent/PYu-RC_Group_51_RoHS_L_7.pdf; Tolerance: ±1%
R54#2 R57#2 R58#2 R59#2 R64 R65 R73 R74 = RES 4.7K OHM 1% 1/10W 0603: 4.7k Ohm ±1% 0.1W, 1/10W Chip Resistor 0603 (1608 Metric) Moisture Resistant Thick Film; Manufacturer 1: Yageo; Manufacturer Part Number 1: RC0603FR-074K7L; Description 1: RES SMD 4.7K OHM 1% 1/10W 0603; Temperature Coefficient: ±100ppm/°C; Supplier 1: Digi-Key; Supplier Part Number 1: 311-4.70KHRCT-ND; RoHS: RoHS Compliant; Category: Resistors; Stock 1: 3487566; Pricing 1: 1=0.16, 10=0.022, 100=0.0089, 1000=0.00402, 2500=0.00349 (CAD); Packaging: Cut Tape (CT); Part Status: Active; Composition: Thick Film; Features: Moisture Resistant; Operating Temperature: -55°C ~ 155°C; Package / Case: 0603 (1608 Metric); Supplier Device Package: 0603; Size / Dimension: 0.063" L x 0.031" W (1.60mm x 0.80mm); Height - Seated (Max): 0.022" (0.55mm); Failure Rate: -; ComponentLink1URL: http://www.yageo.com/documents/recent/PYu-RC_Group_51_RoHS_L_7.pdf; ComponentLink1Description: http://www.yageo.com/documents/recent/PYu-RC_Group_51_RoHS_L_7.pdf; Tolerance: ±1%
R55#2 R69 = RES ARRAY 4 RES 4.7K OHM 1206: 4.7k Ohm ±5% 62.5mW Power Per Element Isolated 4 Resistor Network/Array ±200ppm/°C 1206 (3216 Metric), Convex, Long Side Terminals; Number of Resistors: 4; Applications Automotive: AEC-Q200; Applications: -; Category: Resistors; Circuit Type: Isolated; Part Status: Active; Resistance (Ohms): 4.7k; Tolerance: ±5%; Power Per Element: 62.5mW; Number of Pins: 8; Operating Temperature: -55°C ~ 125°C; Mounting Type: Surface Mount; Package / Case: 1206 (3216 Metric), Convex, Long Side Terminals; Supplier Device Package: 1206; Size / Dimension: 0.126" L x 0.063" W (3.20mm x 1.60mm); Height - Seated (Max): 0.024" (0.60mm); Packaging: Cut Tape (CT); Resistor Matching Ratio: -; Resistor-Ratio-Drift: -; Series: EXB; ComponentLink1Description: https://industrial.panasonic.com/cdbs/www-data/pdf/AOC0000/AOC0000C14.pdf; ComponentLink1URL: https://industrial.panasonic.com/cdbs/www-data/pdf/AOC0000/AOC0000C14.pdf; Supplier 1: Digi-Key; Temperature Coefficient: ±200ppm/°C
R60#2 R62#2 R72 = RES SMD 47 OHM 1% 1/10W 0603: 47 Ohms ±1% 0.1W, 1/10W Chip Resistor 0603 (1608 Metric) Automotive AEC-Q200, Moisture Resistant Thick Film; Temperature Coefficient: ±100ppm/°C; Resistance: 47 Ohms; Operating Temperature: -55°C ~ 155°C; Features: Automotive AEC-Q200, Moisture Resistant; Tolerance: ±1%; Composition: Thick Film; Ratings: AEC-Q200; Package / Case: 0603 (1608 Metric); Number of Terminations: 2; Height - Seated (Max): 0.022" (0.55mm); Size / Dimension: 0.063" L x 0.031" W (1.60mm x 0.80mm); ComponentLink1Description: https://www.yageo.com/upload/media/product/productsearch/datasheet/rchip/PYu-AC_51_RoHS_L_7.pdf; ComponentLink1URL: https://www.yageo.com/upload/media/product/productsearch/datasheet/rchip/PYu-AC_51_RoHS_L_7.pdf; Supplier 1: Digi-Key; Supplier Part Number 1: 311-47LDCT-ND; Supplier Device Package: 0603
R63 = RES 1.21K OHM 1% 1/10W 0603: 1.21k Ohm ±1% 0.1W, 1/10W Chip Resistor 0603 (1608 Metric) Moisture Resistant Thick Film; Manufacturer 1: Yageo; Manufacturer Part Number 1: RC0603FR-071K21L; Temperature Coefficient: ±100ppm/°C; Supplier 1: Digi-Key; Supplier Part Number 1: 311-1.21KHRCT-ND; Packaging: Cut Tape (CT); Part Status: Active; Composition: Thick Film; Operating Temperature: -55°C ~ 155°C; Package / Case: 0603 (1608 Metric); Supplier Device Package: 0603; Size / Dimension: 0.063" L x 0.031" W (1.60mm x 0.80mm); Height - Seated (Max): 0.022" (0.55mm); Failure Rate: -; ComponentLink1URL: http://www.yageo.com/documents/recent/PYu-RC_Group_51_RoHS_L_7.pdf; ComponentLink1Description: http://www.yageo.com/documents/recent/PYu-RC_Group_51_RoHS_L_7.pdf; Tolerance: ±1%
R66 R75 = RES 1.6K OHM 1% 1/10W 0603: 1.6 kOhms ±1% 0.1W, 1/10W Chip Resistor 0603 (1608 Metric) Moisture Resistant Thick Film; Manufacturer: Yageo; Manufacturer Part Number: RC0603FR-071K6L; Voltage Rating: 50V; Temperature Coefficient: 100ppm/°C; Working Voltage: 75V; Supplier 1: Digi-Key; Stock 1: 189550; Pricing 1: 1=0.1, 10=0.015, 100=0.006, 1000=0.0027, 2500=0.0023 (USD); Case/Package: 0603; Case Code (Imperial): 0603; Case Code (Metric): 1608; Min Operating Temperature: -55°C; Max Operating Temperature: 155°C; Tolerance: 1%; Packaging: Tape and Reel; Termination: SMD/SMT; Composition: Thick Film; Military Standard: Not; Voltage Rating (DC): 50V; Number of Terminations: 2; Length: 1.6mm; Depth: 0.8mm; Lead Free: Lead Free; ComponentLink1URL: http://components.arrow.com/part/dataview/0323_00200779; ComponentLink1Description: http://components.arrow.com/part/dataview/0323_00200779; ComponentLink2URL: http://www.yageo.com.tw/exep/pages/download/literatures/PYu-R_INT-thick_7.pdf; ComponentLink2Description: http://www.yageo.com.tw/exep/pages/download/literatures/PYu-R_INT-thick_7.pdf; ComponentLink3URL: http://www.mouser.com/ds/2/447/RC0603-272842.pdf; ComponentLink3Description: http://www.mouser.com/ds/2/447/RC0603-272842.pdf; ComponentLink4URL: http://www.yageo.com/documents/recent/PYu-RC0603_51_RoHS_L_v5.pdf; ComponentLink4Description: http://www.yageo.com/documents/recent/PYu-RC0603_51_RoHS_L_v5.pdf; Supplier Part Number 1: 311-1.60KHRCT-ND
U7#2 U9 = IC LOAD SWITCH BTS7200-2EPA PG-TSDSO-14_1: Power Switch/Driver 1:1 N-Channel 1.2A PG-TSDSO-14-22; Manufacturer: Infineon; Supplier 1: Digi-Key; Supplier Part Number 1: BTS72002EPAXUMA1CT-ND; Stock 1: 1973; Pricing 1: 1=1.31000, 10=1.17500, 100=0.91640, 500=0.75700, 1000=0.59763 (USD); RoHS: No; ComponentLink1Description: https://www.infineon.com/dgdl/Infineon-BTS7200-2EPA-DS-v01_00-EN.pdf?fileId=5546d462636cc8fb016421e548a61215; ComponentLink1URL: https://www.infineon.com/dgdl/Infineon-BTS7200-2EPA-DS-v01_00-EN.pdf?fileId=5546d462636cc8fb016421e548a61215
U8 = IC LOAD SWITCH BTS70401EPA PG-TSDSO-14-22: Power Switch/Driver 1:1 N-Channel 4.5A PG-TSDSO-14-22; Manufacturer: Infineon; Manufacturer Part Number: BTS70401EPAXUMA1; ComponentLink1Description: https://www.infineon.com/dgdl/Infineon-BTS7040-1EPA-DS-v01_00-EN.pdf?fileId=5546d462636cc8fb0163fe8f965308bc; ComponentLink1URL: https://www.infineon.com/dgdl/Infineon-BTS7040-1EPA-DS-v01_00-EN.pdf?fileId=5546d462636cc8fb0163fe8f965308bc; Supplier 1: Digi-Key; Supplier Part Number 1: BTS70401EPAXUMA1CT-ND